# EAGLE design untitled (EAGLE 5.06)
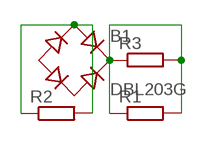
[diagram p0: schematic, sheet 1]

## Parts
B1  DBL203G  [DB]
R1  R-EU_0613/15  [P0613/15]
R2  R-EU_0204/7  [0204/7]
R3  R-EU_0204/7  [0204/7]

## Nets
N$1: B1.+ R1.1 R1.2 R3.1 R3.2
N$2: B1.AC1 R2.1 R2.2
Unconnected: B1.- B1.AC2

## Library data of the parts
B1 = rectifier:DB?*G: Single Phase 1.0 AMP Glass Passivated Bridge Rectifier Taiwan Semiconductor Co.,Ltd. - TSC Source: http://www.taiwansemi.com/TSCbig5/ezcatfiles/cust/img/img/db101g.pdf http://www.ts.com.tw/db/pictures/modules/PDT/PDT060207001/DBLS201G.pdf
R1-R3 = rcl:R-EU_: RESISTOR, European symbol

## Board
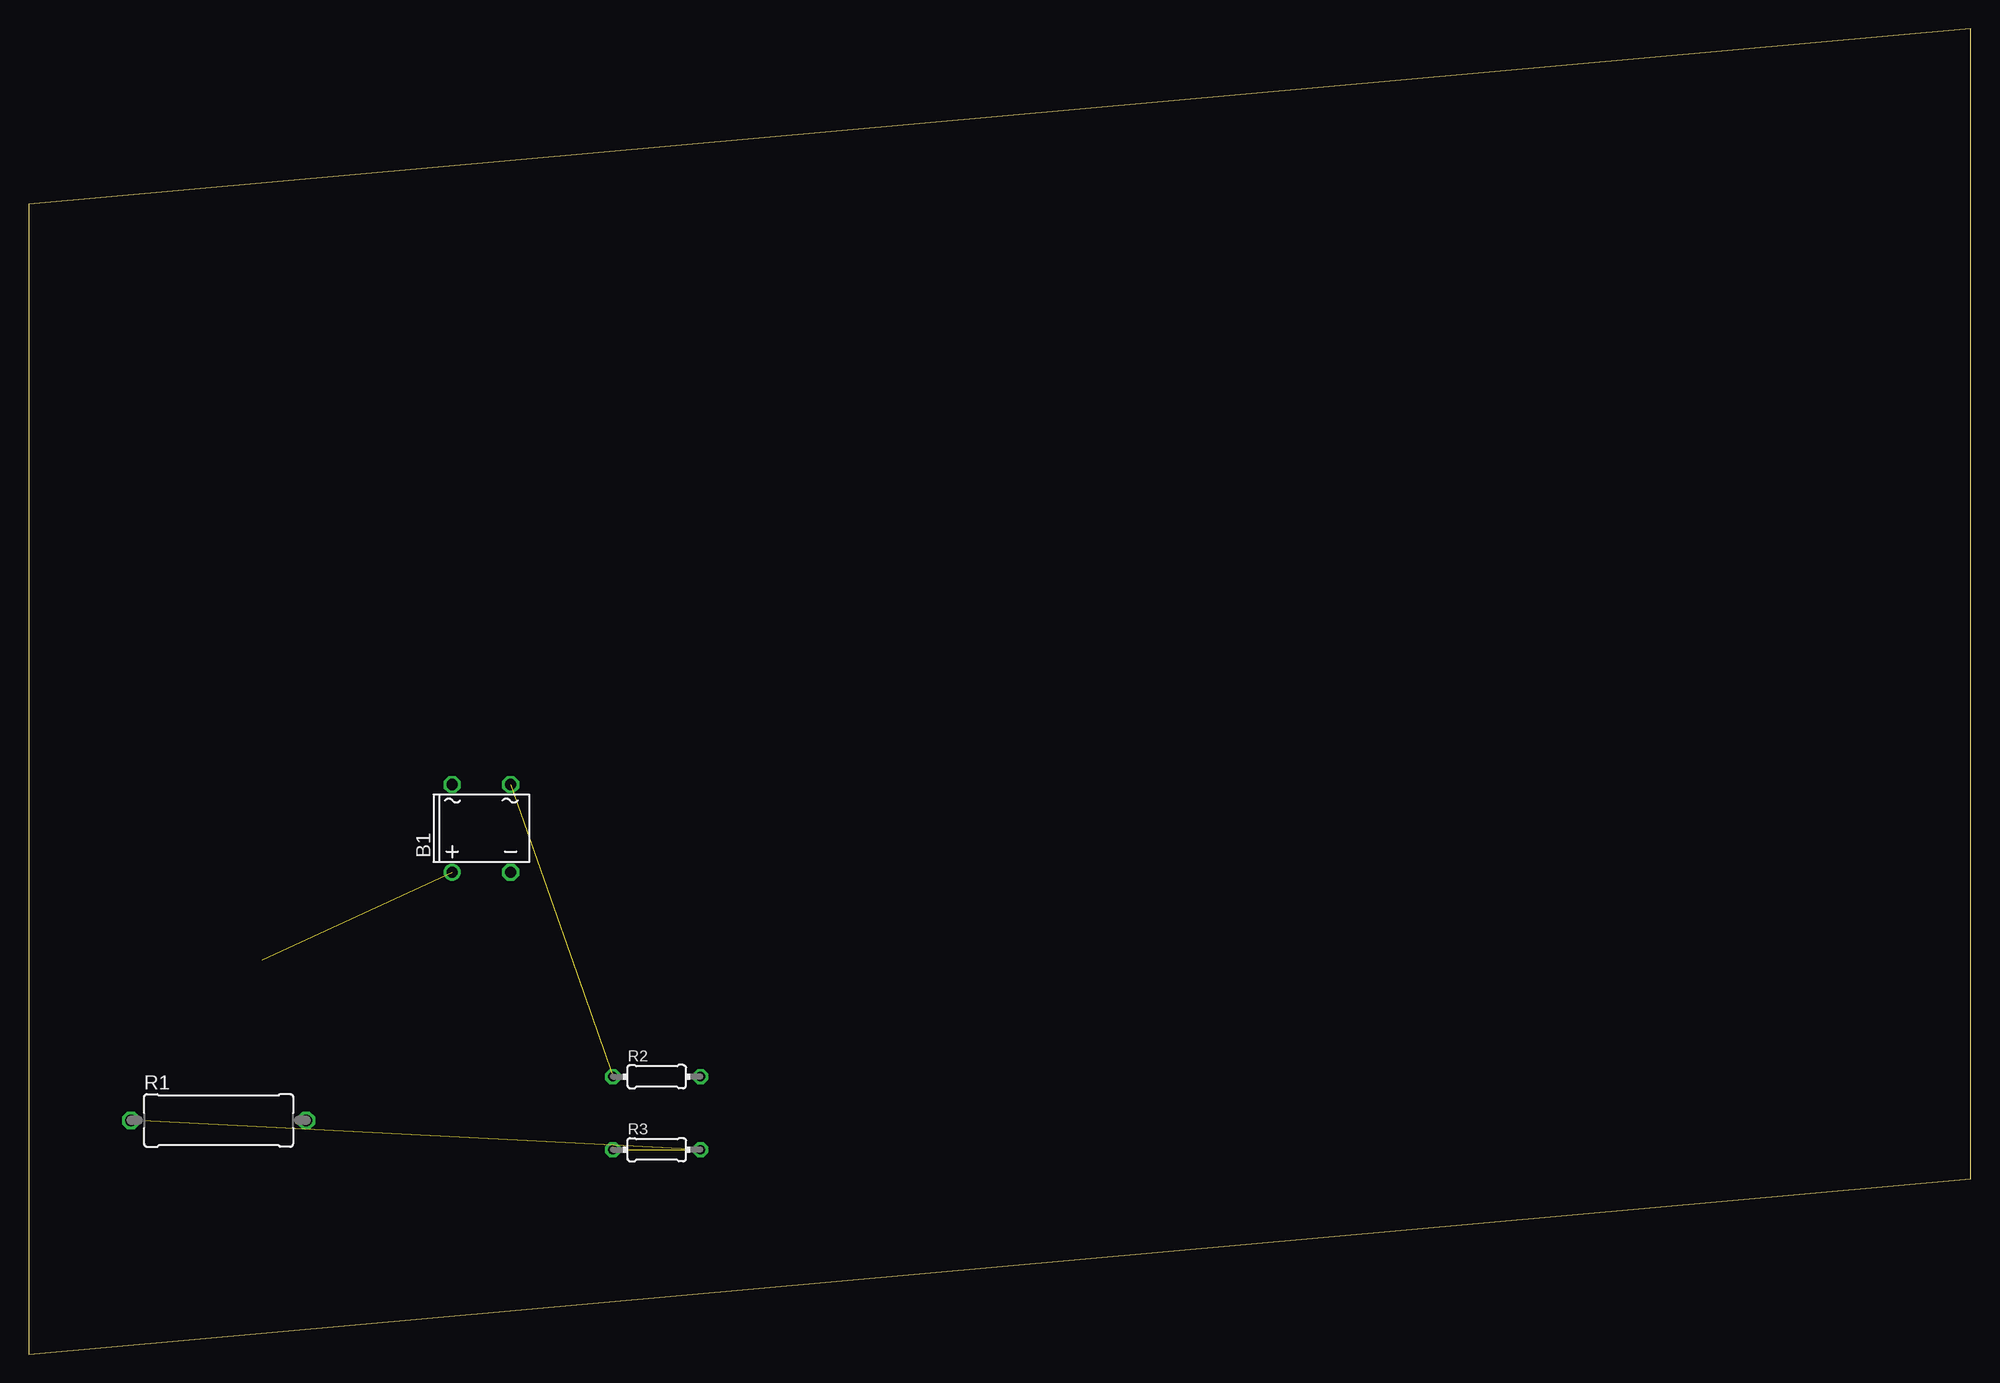
[diagram p1: board, top side]
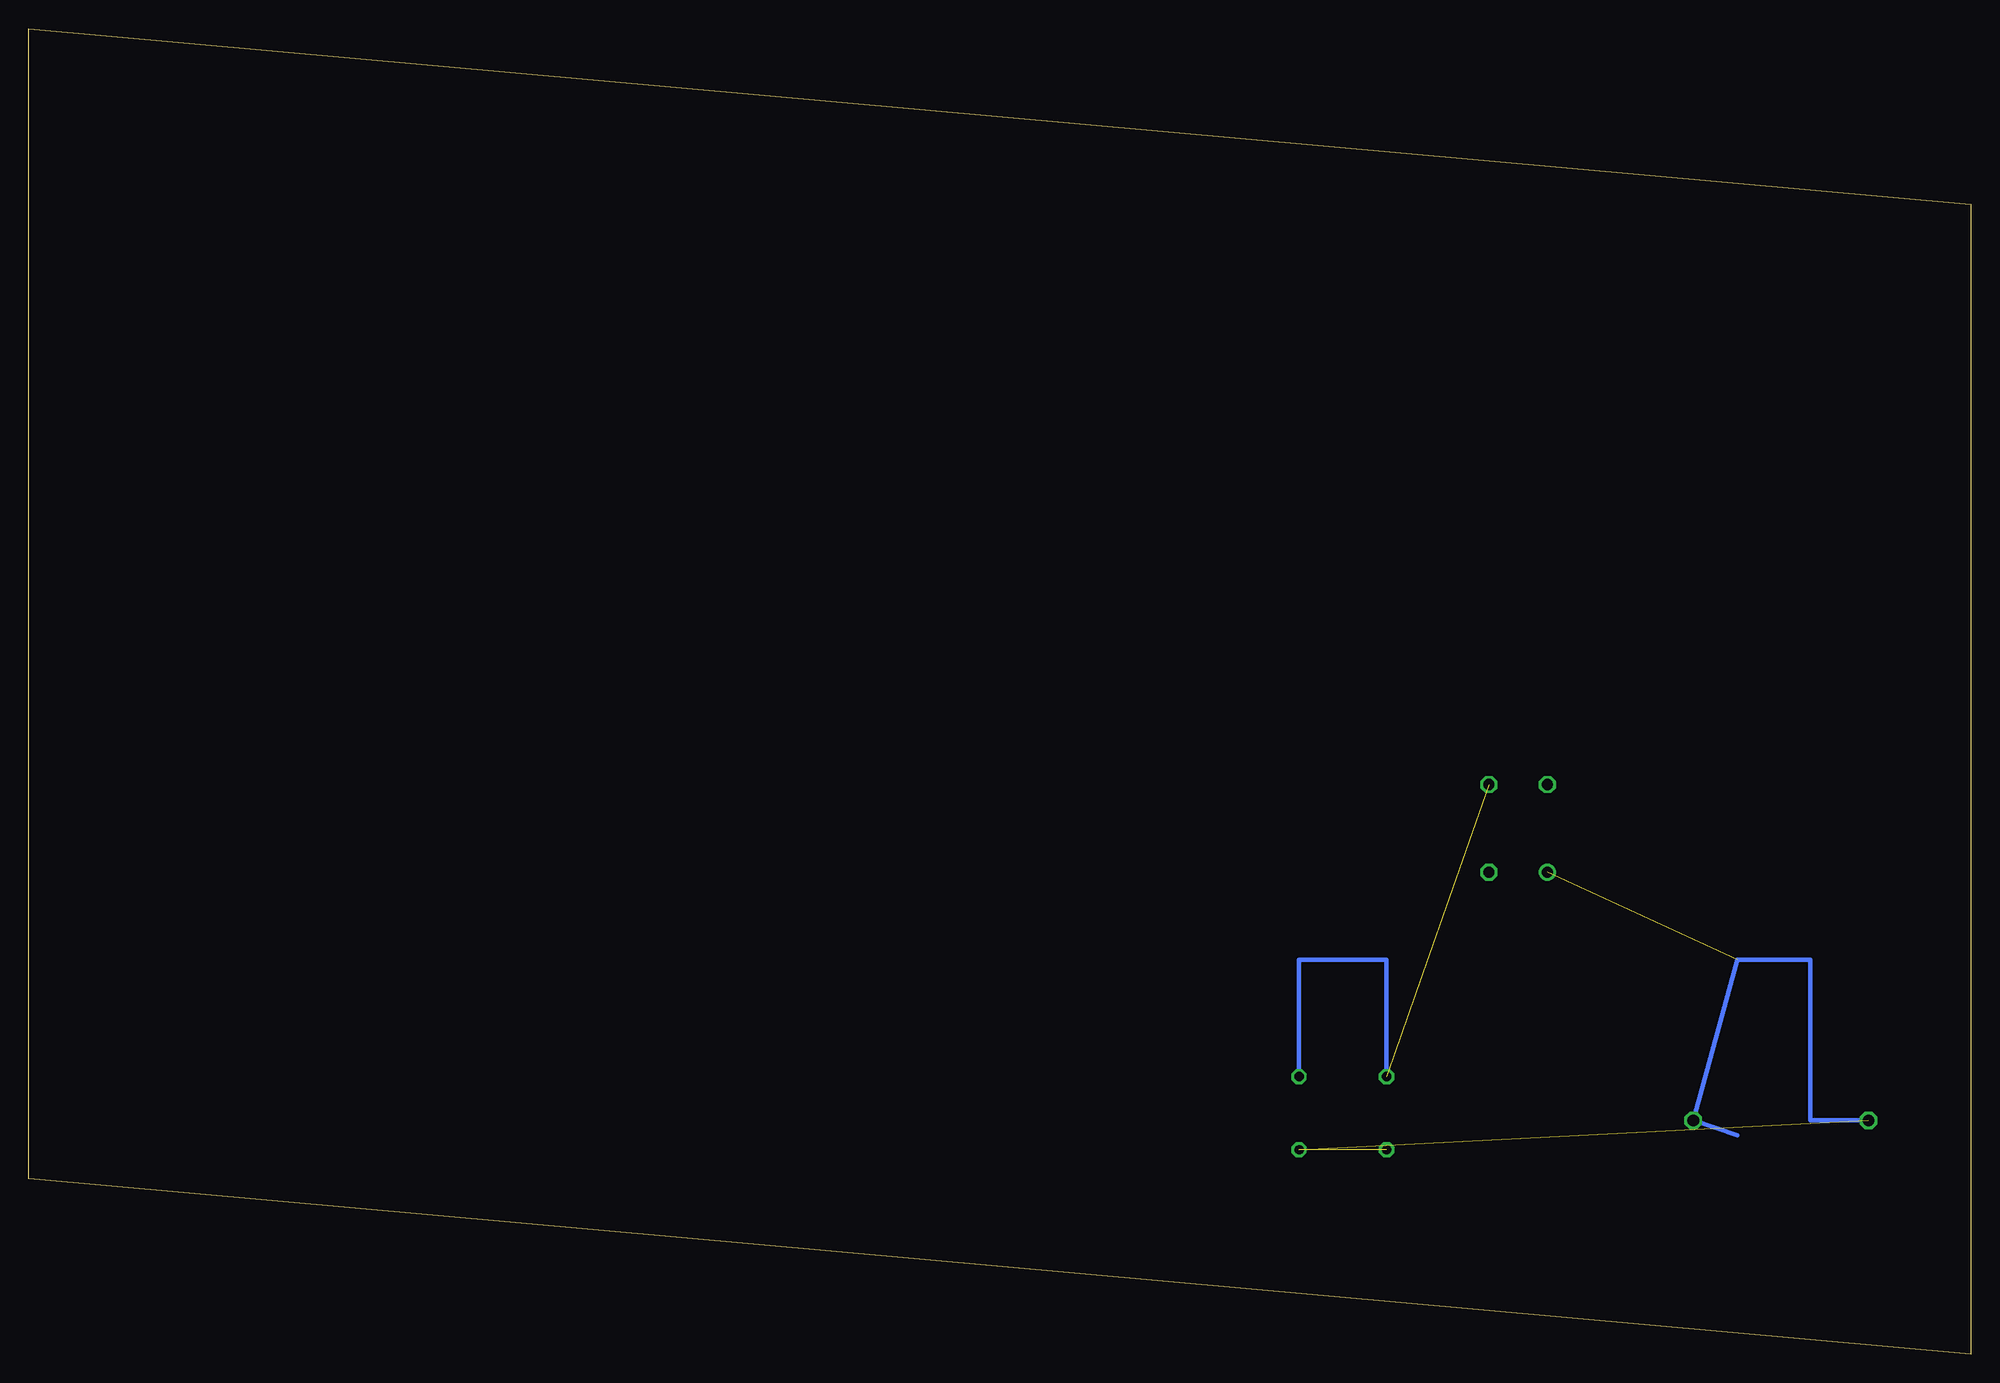
[diagram p2: board, bottom side, seen from below]

Size 168.89 x 115.24 mm. Coordinates in mm from the lower left corner, seen from the top.
Outline: 0,0 168.89,15.24 168.89,115.24 0,100 0,0
Copper layers (1*16): Top 0.035mm / dielectric 1.5mm / Bottom 0.035mm
Design rules "default": minimum track width 10mil, minimum drill 24mil, track to track 8mil, track to pad 8mil, pad to pad 8mil, via to via 8mil, smd to smd 8mil, copper to edge 40mil, drill to drill 8mil, minimum pad ring 10mil, minimum via ring 8mil, stop-mask expansion 4mil, vias tented up to drill 0mil, thermal gap 10mil

### Footprints (pad centres in the part's own frame; a part is rotated, then mirrored left to right if it is on the bottom)
DB = drill 0.963 round: + -2.54,-3.81 | drill 0.963 octagon: - 2.54,-3.81; AC1 2.54,3.81; AC2 -2.54,3.81
P0613/15 = drill 1.016 octagon: 1 -7.62,0; 2 7.62,0
0204/7 = drill 0.813 octagon: 1 -3.81,0; 2 3.81,0

### Placement (x,y rotation side)
B1  39.37,45.72 0 top
R1  16.51,20.32 0 top
R2  54.61,24.13 0 top
R3  54.61,17.78 0 top

### Tracks (layer width: path | path; a pad name or v marks a point on that pad's centre or on a via)
N$1  (3 unrouted)
  Bottom 0.406: R1.1 13.97,20.32 13.97,34.29 20.32,34.29 R1.2 20.32,19.05
N$2  (1 unrouted)
  Bottom 0.406: R2.1 50.8,34.29 58.42,34.29 R2.2